# Altium schematic sheet KNoT-Gateway Mini Starter Board.SchDoc: KNOT Gateway Starter Mini
size A4; Organization: CESAR; Address1: Rua Bione, 220; Address2: Bairro do Recife; Address3: Recife - PE - BRASIL; Address4: 50030-390; Revision: 01.00; SheetNumber: 1; SheetTotal: 1
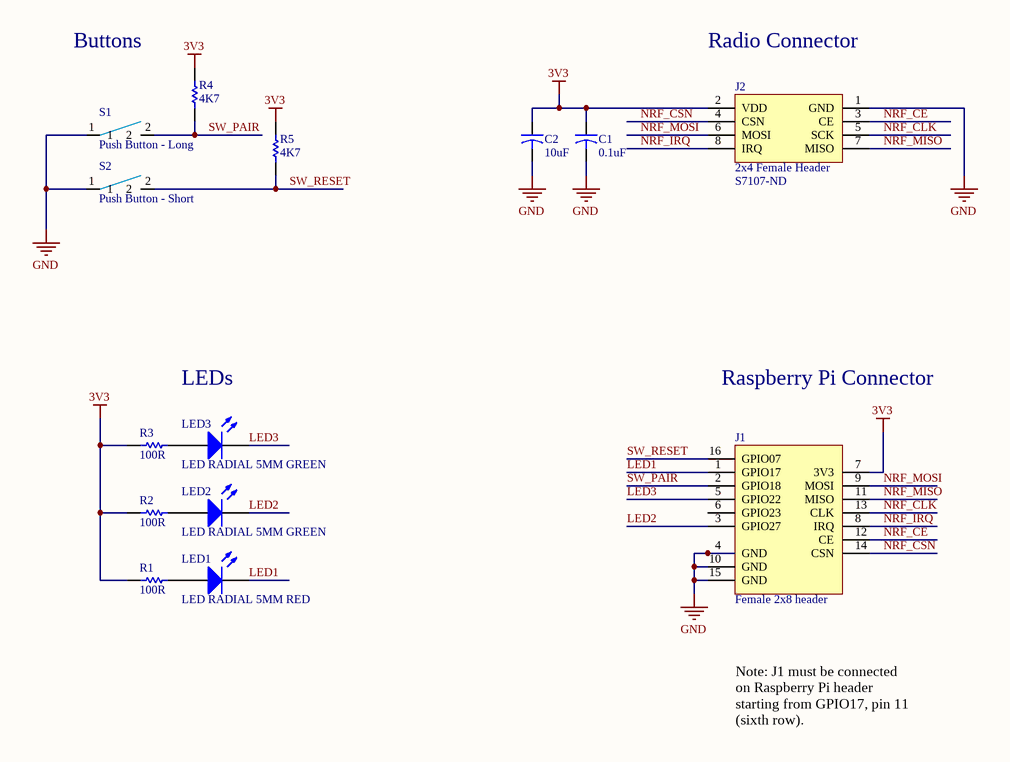
[diagram p0: KNoT-Gateway Mini Starter Board.SchDoc]

## Parts
C1  value 0.1uF  [0805_CAPS]  (hidden comment: Cap 0805 0.1uF)
C2  value 10uF  [0805_CAPS]  (hidden comment: Cap 0805 10uF)
J1  Female 2x8 header  [FEMALE HEADER 2X8]
J2  2x4 Female Header  Supplier Part Number 1: S7107-ND  [nRF24L01+PA+LNA]
LED1  LED RADIAL 5MM RED  [LED RADIAL 5MM RED]
LED2  LED RADIAL 5MM GREEN  [LED RADIAL 5MM GREEN]
LED3  LED RADIAL 5MM GREEN  [LED RADIAL 5MM GREEN]
R1  value 100R  [0805_RES]  (hidden comment: RES_0805)
R2  value 100R  [0805_RES]  (hidden comment: RES_0805)
R3  value 100R  [0805_RES]  (hidden comment: RES_0805)
R4  value 4K7  [0805_RES]  (hidden comment: RES_0805)
R5  value 4K7  [0805_RES]  (hidden comment: RES_0805)
S1  Push Button - Long  [Tac Push Button L]
S2  Push Button - Short  [Tac Push Button S]

## Nets
3V3: C1.1 C2.1 J1.7(3V3) J2.2(VDD) R1.2 R2.2 R3.2 R4.2 R5.2
GND: C1.2 C2.2 J1.4(GND) J1.10(GND) J1.15(GND) J2.1(GND) S1.1 S2.1
LED1: J1.1(GPIO17) LED1.2(K)
LED2: J1.3(GPIO27) LED2.2(K)
LED3: J1.5(GPIO22) LED3.2(K)
NRF_CE: J1.12(CE) J2.3(CE)
NRF_CLK: J1.13(CLK) J2.5(SCK)
NRF_CSN: J1.14(CSN) J2.4(CSN)
NRF_IRQ: J1.8(IRQ) J2.8(IRQ)
NRF_MISO: J1.11(MISO) J2.7(MISO)
NRF_MOSI: J1.9(MOSI) J2.6(MOSI)
SW_PAIR: J1.2(GPIO18) R4.1 S1.2
SW_RESET: J1.16(GPIO07) R5.1 S2.2
NetLED1_1: LED1.1(A) R1.1
NetLED2_1: LED2.1(A) R2.1
NetLED3_1: LED3.1(A) R3.1

Not connected (* = marked no-connect by the designer): J1 6(GPIO23)

## Notes on the sheet
- Buttons
- Radio Connector
- LEDs
- Raspberry Pi Connector
- Note: J1 must be connected on Raspberry Pi header starting from GPIO17, pin 11 (sixth row).
- Title
- Size:
- Date:
- A4
- Number:
- Time:
- Revision:
- Sheet
- of
- File:

## Library data of the parts
C1 = Cap_0805_0.1uF: 0.1µF  Ceramic Capacitor 0805; Supplier 1: Digi-Key; Value Part Number 1: 0.1uF; Supplier Part Number 1: 445-8883-1-ND
C2 = Cap_0805_10uF: 10uF Ceramic Capacitor 0805; Supplier 1: Digi-Key; Supplier Part Number 1: 709-1229-1-ND; Value Part Number 1: 10uF
J1 = 2x8 RPi Header: Female Bottom 2x4 Header; Supplier 1: Digi-Key; Supplier Part Number 1: S7076-ND
J2 = nRF24L01+: nRF24L01 2x4 HEADER; Supplier 1: Digi-Key
LED1 = LED RADIAL 5MM RED: LED RADIAL; Supplier 1: Digi-Key; Supplier Part Number 1: 160-1853-ND
LED2 LED3 = LED RADIAL 5MM GREEN: LED RADIAL; Supplier 1: Digi-Key; Supplier Part Number 1: 160-1852-ND
R1-R5 = RES_0805: Precision Thick Film Chip Resistor, 10 Ohm to 1M Ohm Range, 1% and 0.5% Tolerance, 0805 Size, 1/8 W; Supplier 1: Digi-Key
  R1-R3: Supplier Part Number 1: 311-100ARCT-ND
  R4 R5: Supplier Part Number 1: 311-4.7KARCT-ND
S1 = Push Button L: Tactile Push Button Right Angle; Supplier 1: Digi-Key; Supplier Part Number 1: P10880S-ND
S2 = Push Button S: Tactile Push Button Right Angle; Supplier 1: Digi-Key; Supplier Part Number 1: P10883S-ND